# EAGLE schematic PIPCB (EAGLE 8.7.1)
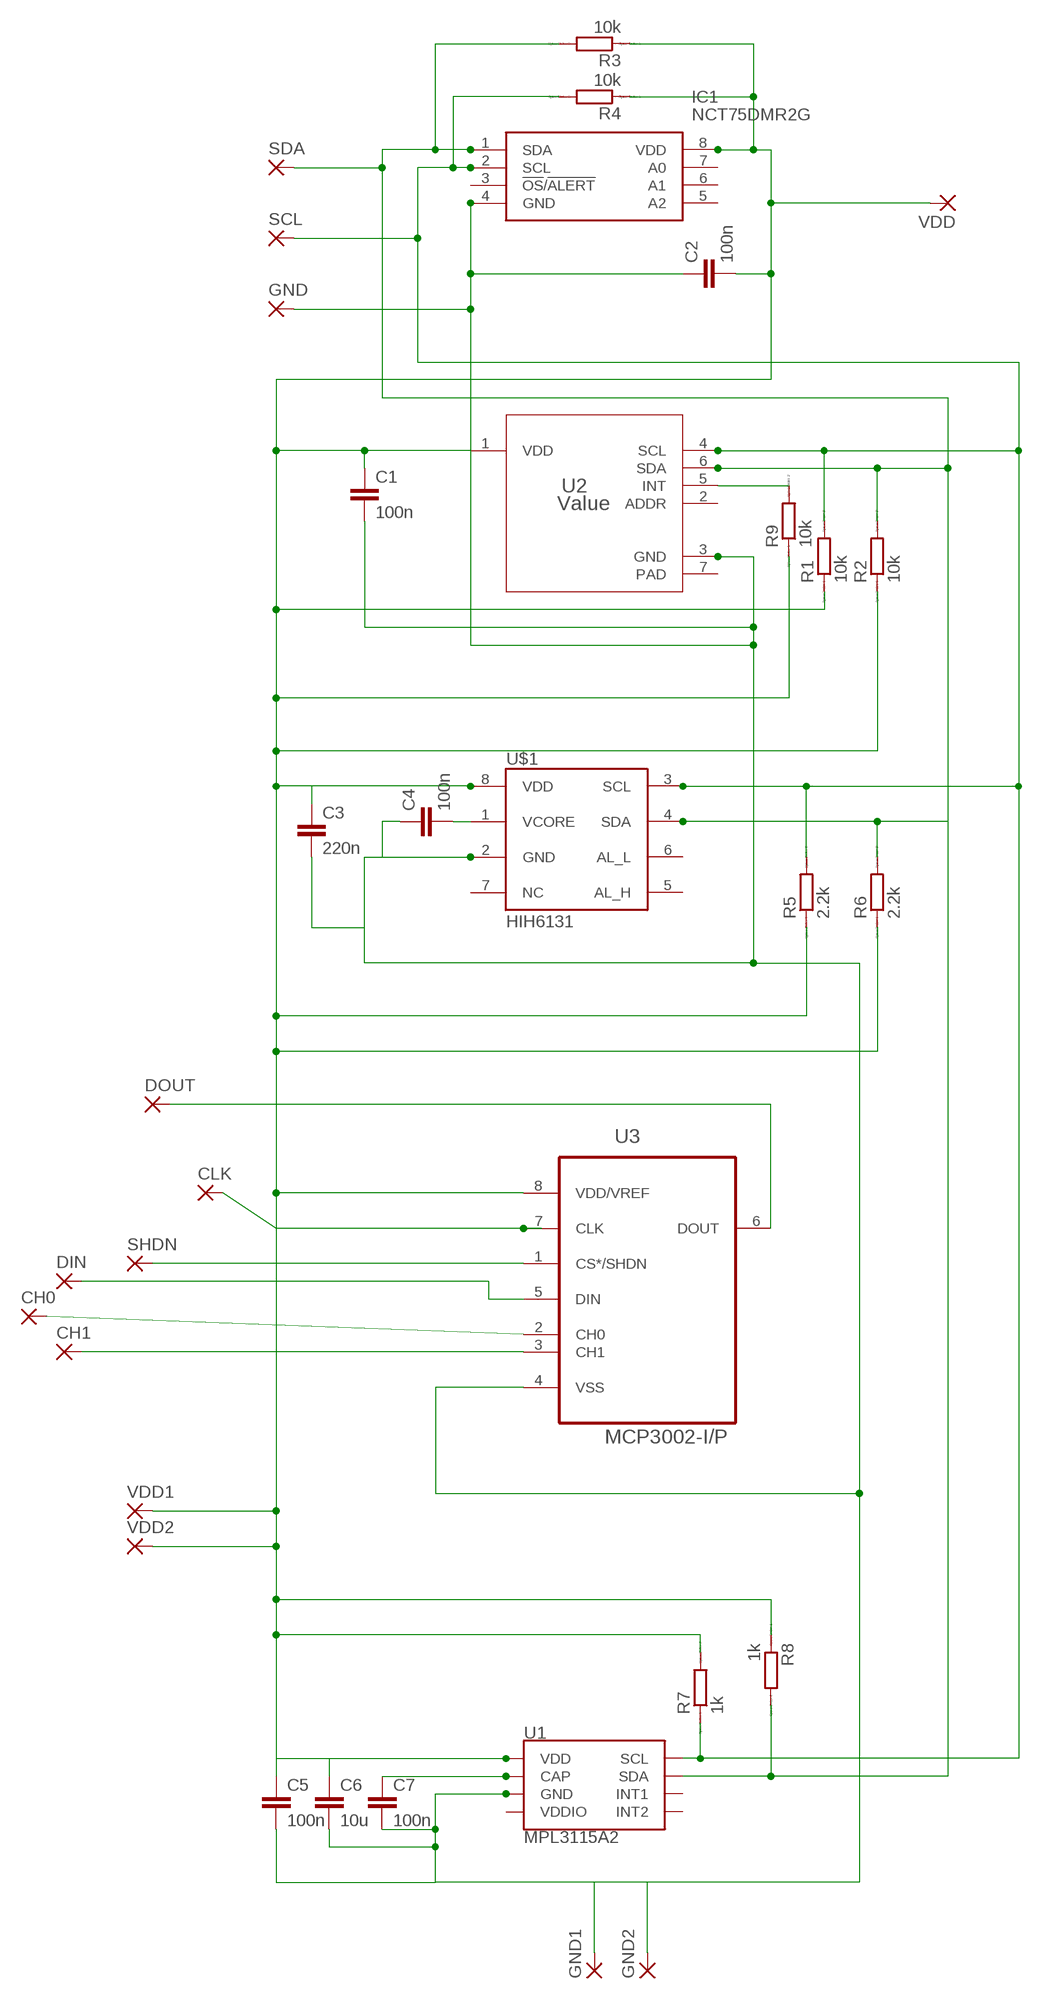
[diagram p0: schematic, sheet 1]

## Parts
C1  100n  C2,5-3  [C2.5-3]
C2  100n  C2,5-3  [C2.5-3]
C3  220n  C2,5-3  [C2.5-3]
C4  100n  C2,5-3  [C2.5-3]
C5  100n  C2,5-3  [C2.5-3]
C6  10u  C2,5-3  [C2.5-3]
C7  100n  C2,5-3  [C2.5-3]
CH0  2,54/0,8  [2,54/0,8]
CH1  2,54/0,8  [2,54/0,8]
CLK  2,54/0,8  [2,54/0,8]
DIN  2,54/0,8  [2,54/0,8]
DOUT  2,54/0,8  [2,54/0,8]
GND  2,54/0,8  [2,54/0,8]
GND1  2,54/0,8  [2,54/0,8]
GND2  2,54/0,8  [2,54/0,8]
IC1  NCT75DMR2G  [SOP65P490X110-8N]
R1  10k  R0207/10  [0207/10]
R2  10k  R0207/10  [0207/10]
R3  10k  R0207/10  [0207/10]
R4  10k  R0207/10  [0207/10]
R5  2.2k  R0207/10  [0207/10]
R6  2.2k  R0207/10  [0207/10]
R7  1k  R0207/10  [0207/10]
R8  1k  R0207/10  [0207/10]
R9  10k  R0207/10  [0207/10]
SCL  2,54/0,8  [2,54/0,8]
SDA  2,54/0,8  [2,54/0,8]
SHDN  2,54/0,8  [2,54/0,8]
U1  MPL3115A2  [LGA-8-5X3]
U2  Value  OPT3001DNPR  [DNP0006A]
U3  MCP3002-I/P  [DIP254P762X533-8]
U$1  HIH6131  [SOIC8]
VDD  2,54/0,8  [2,54/0,8]
VDD1  2,54/0,8  [2,54/0,8]
VDD2  2,54/0,8  [2,54/0,8]

## Nets
GND: C1.2 C2.1 C3.2 C4.1 C5.2 C6.2 C7.2 GND1.1(P) GND2.1(P) GND.1(P) IC1.4(GND) U1.3(GND) U2.3(GND) U3.4(VSS) U$1.2(GND)
N$1: C1.1 C2.2 C3.1 C5.1 C6.1 IC1.8(VDD) R1.1 R2.1 R3.1 R4.1 R5.1 R6.1 R7.2 R8.1 R9.1 U1.1(VDD) U2.1(VDD) U3.8(VDD/VREF) U$1.8(VDD) VDD1.1(P) VDD2.1(P) VDD.1(P)
N$3: IC1.2(SCL) R1.2 R4.2 R5.2 R7.1 SCL.1(P) U1.8(SCL) U2.4(SCL) U$1.3(SCL)
N$4: IC1.1(SDA) R2.2 R3.2 R6.2 R8.2 SDA.1(P) U1.7(SDA) U2.6(SDA) U$1.4(SDA)
N$6: C4.2 U$1.1(VCORE)
N$7: DOUT.1(P) U3.6(DOUT)
N$8: CLK.1(P) U3.7(CLK)
N$9: SHDN.1(P) U3.1(CS*/SHDN)
N$10: C7.1 U1.2(CAP)
N$11: DIN.1(P) U3.5(DIN)
N$12: CH0.1(P) U3.2(CH0)
N$13: CH1.1(P) U3.3(CH1)
N$14: R9.2 U2.5(INT)
Unconnected: IC1.3(!OS!/!ALERT) IC1.5(A2) IC1.6(A1) IC1.7(A0) U1.5(INT2) U1.6(INT1) U2.2(ADDR) U2.7(PAD) U$1.5(AL_H) U$1.6(AL_L) U$1.7(NC)

## Power pins joined to a net without a drawn wire
VDDIO: U1.4(VDDIO)

## Library data of the parts
C1-C7 = capacitor-wima:C: CAPACITOR naming: grid - package width
CH0 CH1 CLK DIN DOUT GND GND1 GND2 SCL SDA SHDN VDD VDD1 VDD2 = wirepad:2,54/0,8: THROUGH-HOLE PAD
IC1 = NCT75DMR2G:NCT75DMR2G: Source: Datasheet <http://www.onsemi.com/pub/Collateral/NCT75-D.PDF>; ALLIED_NUMBER: 70467170; ALLIED_PRICE/STOCK: http://www.alliedelec.com/on-semiconductor-nct75dmr2g/70467170/; HEIGHT: 1.1mm; MANUFACTURER_NAME: ON Semiconductor; MANUFACTURER_PART_NUMBER: NCT75DMR2G; RS_PART_NUMBER: 8064942; RS_PRICE/STOCK: http://uk.rs-online.com/web/p/products/8064942
R1-R9 = eagle-ltspice:R: RESISTOR, European symbol; SPICEMODEL: NONE; SPICEPREFIX: R
U1 = SparkFun-Sensors:MPL3115A2: NXP MPL3115A2 Digital Altimeter/Pressure Sensor The MPL3115A2 is a compact piezoresistive absolute pressure sensor with an I2C interface. MPL3115 has a wide operating range of 20kPa to 110 kPa, a range that covers all surface elevations on Earth. The fully internally compensated MEMS in conjunction with an embedded high resolution 24-bit equivalent ADC provide accurate pressure [Pascals] /altitude [meters] and temperature [degrees Celsius] data. Datasheet <http://cdn.sparkfun.com/datasheets/Sensors/Pressure/MPL3115A2.pdf> SparkFun Products SparkFun Altitude/Pressure Sensor Breakout - MPL3115A2 <https://www.sparkfun.com/products/11084> (SEN-11084) SparkFun Weather Shield <https://www.sparkfun.com/products/12081> (DEV-12081) SparkFun Photon Weather Shield <https://www.sparkfun.com/products/13630> (DEV-13630); PROD_ID: IC-10869
U2 = newlib:OPT3001DNPR; APPLICATION_BUILDNUMBER: *; COMPTYPE: IC; MANUFACTURER: Texas Instruments; MOUNTTYPE: SMT; PACKAGEREFERENCE: DNP0006A; PARTNUMBER: OPT3001DNP; PIN_COUNT: 7; REFDES: RefDes; ROHS: Y; TYPE: TYPE
U3 = newlib:MCP3002-I/P: IC, ADC, 10BIT, 200KSPS, DIP-8; MPN: MCP3002-I/P; OC_FARNELL: 1852015; OC_NEWARK: 61K2948; PACKAGE: DIP-8; SUPPLIER: Microchip
U$1 = SparkFun-Retired:HIH6131: Humidity sensor Not in catalog